# EAGLE design ESP_Irrigation (EAGLE 6.4)
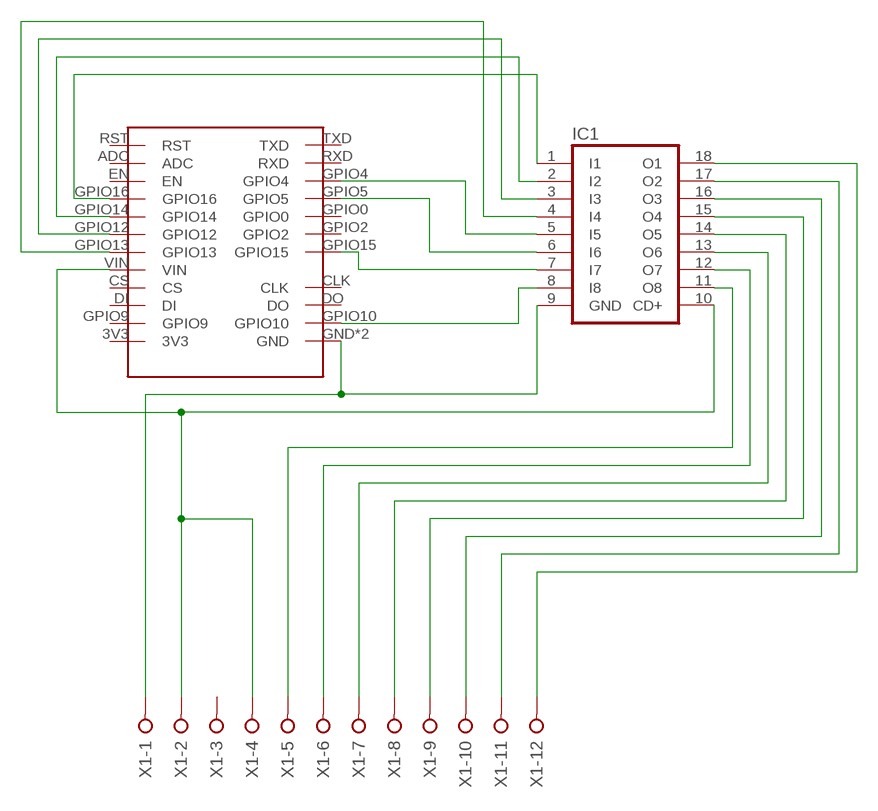
[diagram p0: schematic, sheet 1]

## Parts
IC1  ULN2803A  [DIL18]
U$1  ESP12ADAPTERBOARD  [ESP12ADAPTERBOARD]
X1  W237-12P  [W237-12P]

## Nets
N$1: IC1.17(O2) X1.11
N$2: IC1.9(GND) U$1.GND U$1.GND1(GND) X1.1
N$3: IC1.11(O8) X1.5
N$4: IC1.8(I8) U$1.GPIO10
N$5: IC1.7(I7) U$1.GPIO15
N$6: IC1.5(I5) U$1.GPIO4
N$7: IC1.6(I6) U$1.GPIO5
N$8: IC1.4(I4) U$1.GPIO13
N$10: IC1.3(I3) U$1.GPIO12
N$12: IC1.12(O7) X1.6
N$13: IC1.13(O6) X1.7
N$14: IC1.14(O5) X1.8
N$15: IC1.15(O4) X1.9
N$16: IC1.16(O3) X1.10
N$17: IC1.10(CD+) U$1.VIN X1.2 X1.4
N$18: IC1.18(O1) X1.12
N$19: IC1.1(I1) U$1.GPIO16
N$20: IC1.2(I2) U$1.GPIO14
Unconnected: U$1.3V3 U$1.ADC U$1.CLK U$1.CS U$1.DI U$1.DO U$1.EN U$1.GPIO0 U$1.GPIO2 U$1.GPIO9 U$1.RST U$1.RXD U$1.TXD X1.3

## Library data of the parts
IC1 = uln-udn:ULN2803A: DRIVER ARRAY
U$1 = esp8266modules:ESP12ADAPTERBOARD
X1 = con-wago-508:W237-12P: WAGO SREW CLAMP; OC_FARNELL: unknown; OC_NEWARK: unknown

## Board
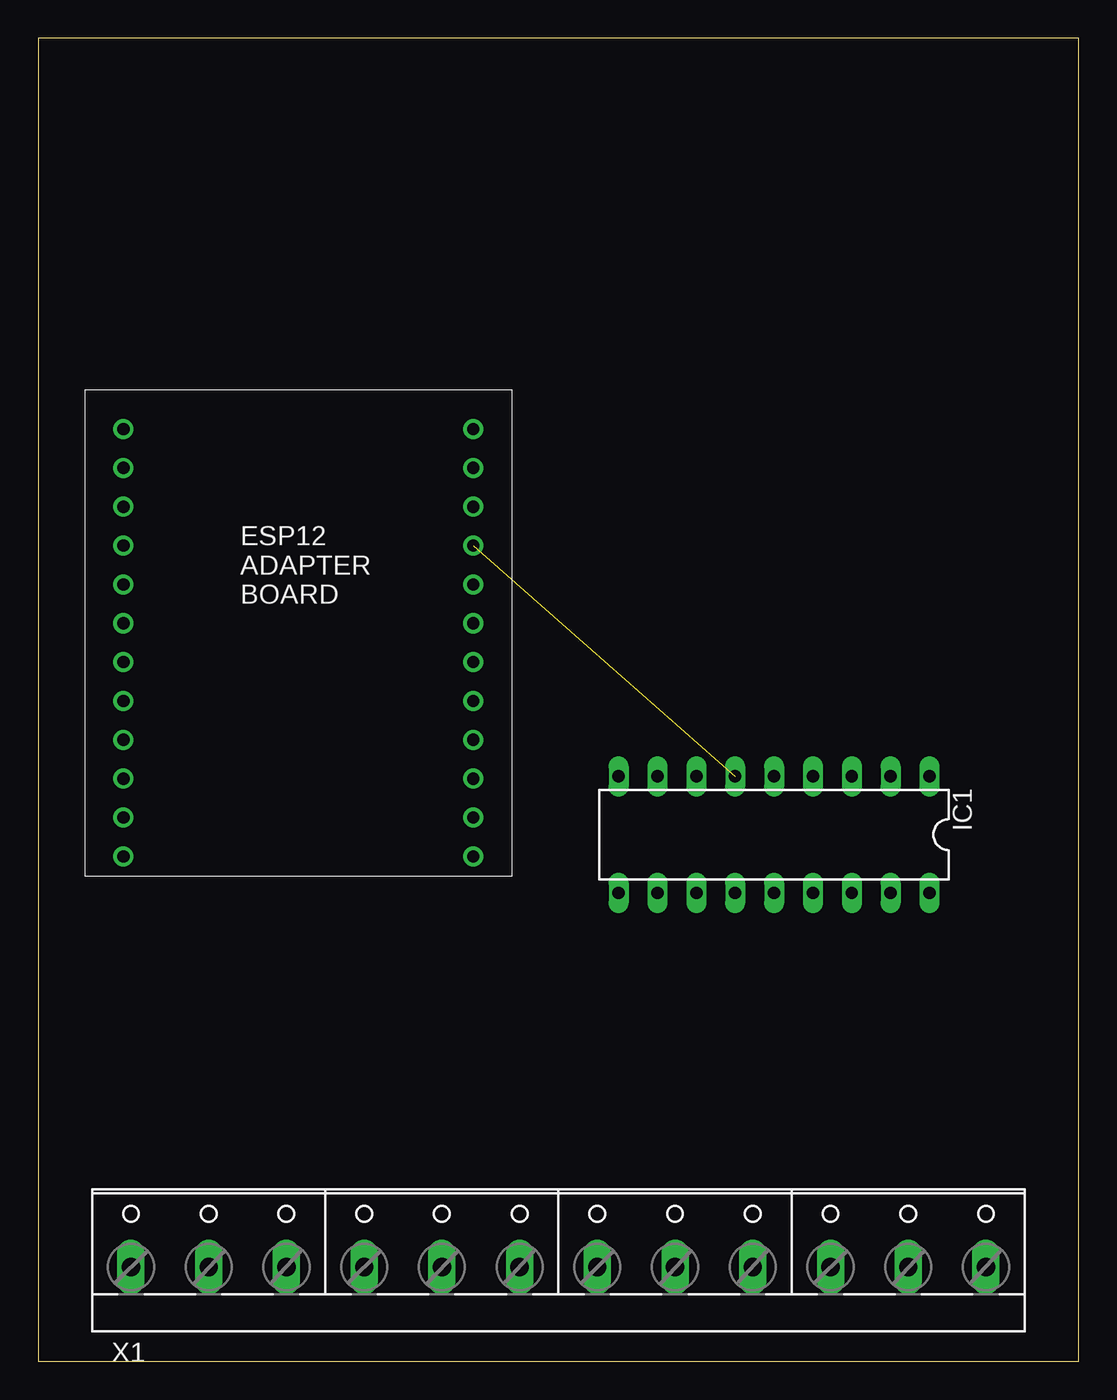
[diagram p1: board, top side]
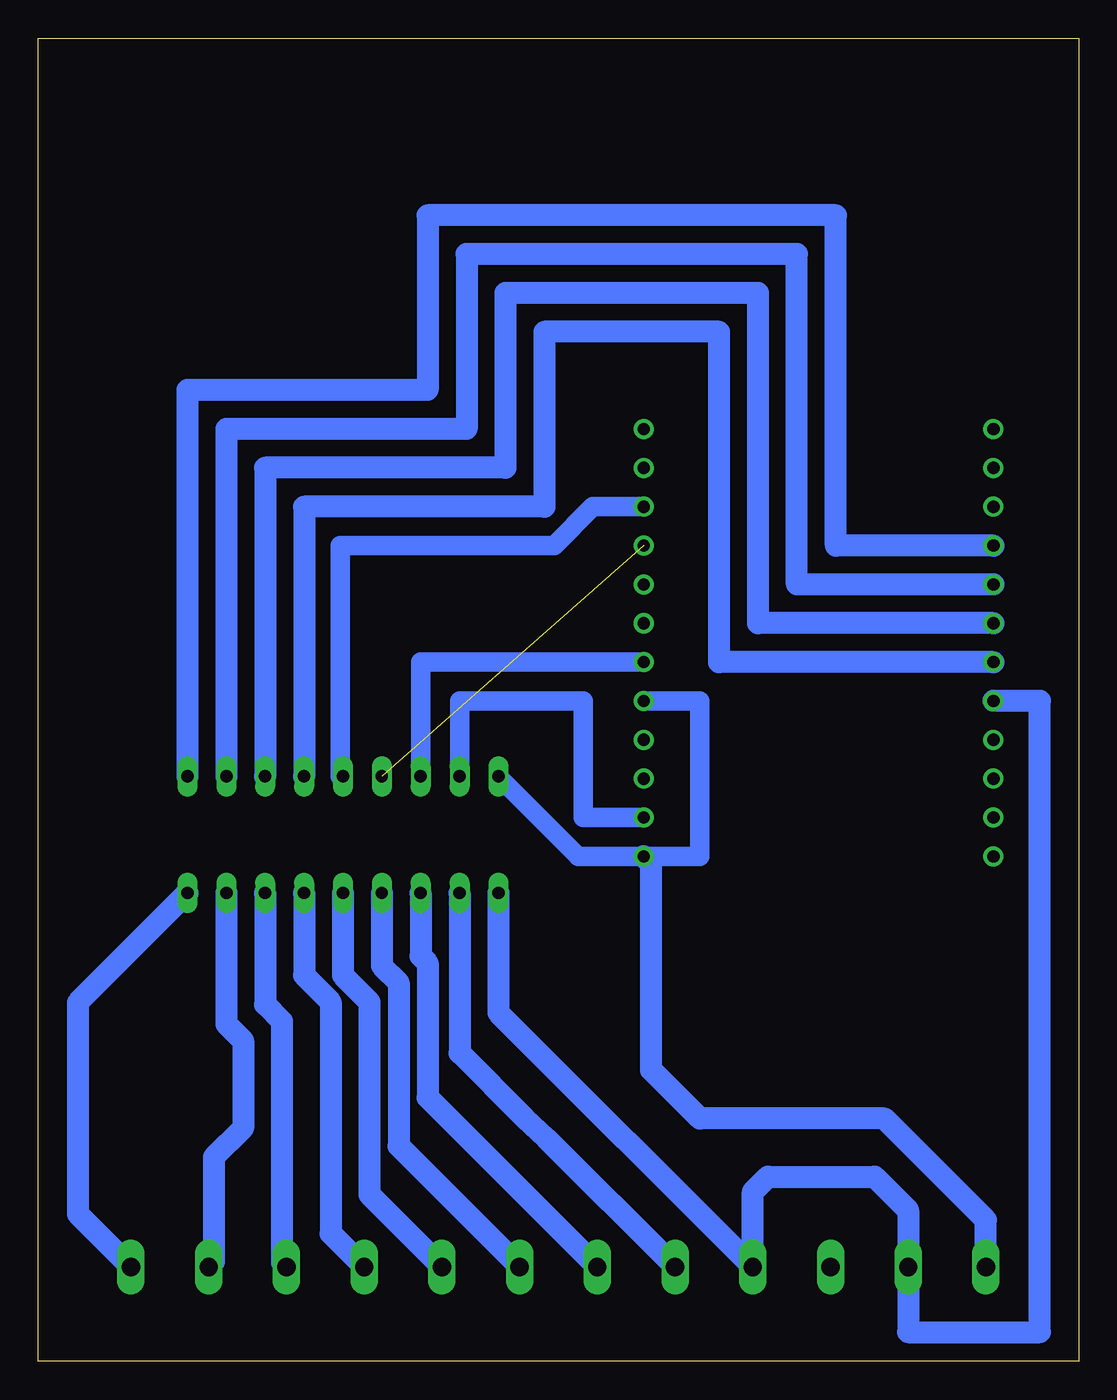
[diagram p2: board, bottom side, seen from below]

Size 68 x 86.5 mm. Coordinates in mm from the lower left corner, seen from the top.
Outline: 0,0 68,0 68,86.5 0,86.5 0,0
Copper layers (1*16): Top 0.035mm / dielectric 1.5mm / Bottom 0.035mm
Design rules "default": minimum track width 10mil, minimum drill 24mil, track to track 8mil, track to pad 8mil, pad to pad 8mil, via to via 8mil, smd to smd 8mil, copper to edge 40mil, drill to drill 8mil, minimum pad ring 10mil, minimum via ring 8mil, stop-mask expansion 4mil, vias tented up to drill 0mil, thermal gap 10mil

### Footprints (pad centres in the part's own frame; a part is rotated, then mirrored left to right if it is on the bottom)
DIL18 = drill 0.813 long: 1 -10.16,-3.81; 2 -7.62,-3.81; 3 -5.08,-3.81; 4 -2.54,-3.81; 5 0,-3.81; 6 2.54,-3.81; 7 5.08,-3.81; 8 7.62,-3.81; 9 10.16,-3.81; 10 10.16,3.81; 11 7.62,3.81; 12 5.08,3.81; 13 2.54,3.81; 14 0,3.81; 15 -2.54,3.81; 16 -5.08,3.81; 17 -7.62,3.81; 18 -10.16,3.81
ESP12ADAPTERBOARD = drill 0.8: 3V3 -11.43,-13.97; ADC -11.43,11.43; CLK 11.43,-6.35; CS -11.43,-8.89; DI -11.43,-6.35; DO 11.43,-8.89; EN -11.43,8.89; GND 11.43,-3.81; GND1 11.43,-13.97; GPIO0 11.43,3.81; GPIO2 11.43,1.27; GPIO4 11.43,8.89; GPIO5 11.43,6.35; GPIO9 -11.43,-11.43; GPIO10 11.43,-11.43; GPIO12 -11.43,1.27; GPIO13 -11.43,-1.27; GPIO14 -11.43,3.81; GPIO15 11.43,-1.27; GPIO16 -11.43,6.35; RST -11.43,13.97; RXD 11.43,11.43; TXD 11.43,13.97; VIN -11.43,-3.81
W237-12P = drill 1.194 long: 1 -27.94,-0.635; 2 -22.86,-0.635; 3 -17.78,-0.635; 4 -12.7,-0.635; 5 -7.62,-0.635; 6 -2.54,-0.635; 7 2.54,-0.635; 8 7.62,-0.635; 9 12.7,-0.635; 10 17.78,-0.635; 11 22.86,-0.635; 12 27.94,-0.635

### Placement (x,y rotation side)
IC1  48.09,34.43 180 top
U$1  17,46.98 0 top
X1  34,6.8 0 top

### Tracks (layer width: path | path; a pad name or v marks a point on that pad's centre or on a via)
N$1
  Bottom 1.422: IC1.17 55.71,22.05 54.61,20.95 54.61,15.24 56.52,13.34 56.52,6.51 X1.11
N$2
  Bottom 1.27: IC1.9 32.71,33.02 U$1.GND1 24.77,33.02 24.77,43.18 U$1.GND
  Bottom 1.422: U$1.GND1 27.94,32.52 27.94,19.05 24.77,15.88 12.7,15.88 6.06,9.23 X1.1
N$3
  Bottom 1.422: IC1.11 40.47,20.15 36.2,15.88 34.82,14.61 X1.5
N$4
  Bottom 1.27: U$1.GPIO10 32.38,35.55 32.38,43.18 40.47,43.18 IC1.8
N$5
  Bottom 1.27: U$1.GPIO15 43.01,45.71 IC1.7
N$6
  Bottom 1.27: IC1.5 48.26,38.24 48.26,53.34 34.29,53.34 31.76,55.87 U$1.GPIO4
N$7  (1 unrouted)
N$8
  Bottom 1.422: U$1.GPIO13 23.5,45.71 23.5,67.31 34.92,67.31 34.92,55.88 50.63,55.88 IC1.4
N$10
  Bottom 1.422: U$1.GPIO12 20.95,48.25 20.95,69.85 37.47,69.85 37.47,58.42 53.17,58.42 IC1.3
N$12
  Bottom 1.422: IC1.12 43.01,26.5 42.55,26.04 42.55,17.25 X1.6
N$13
  Bottom 1.422: IC1.13 45.55,25.86 44.45,24.77 44.45,14.07 X1.7
N$14
  Bottom 1.422: IC1.14 48.09,25.23 46.35,23.5 46.35,10.9 X1.8
N$15
  Bottom 1.422: IC1.15 50.63,25.23 48.9,23.5 48.9,8.36 X1.9
N$16
  Bottom 1.422: IC1.16 53.17,23.32 52.07,22.23 52.07,6.46 X1.10
N$17
  Bottom 1.422: IC1.10 37.93,22.79 X1.4 21.3,11.09 20.32,12.06 13.34,12.06 11.14,9.87 X1.2 11.14,1.91 2.54,1.91 2.54,43.17 U$1.VIN
N$18
  Bottom 1.422: IC1.18 65.41,23.46 65.41,9.63 X1.12
N$19
  Bottom 1.422: U$1.GPIO16 15.88,53.33 15.88,74.93 42.55,74.93 42.55,63.5 58.25,63.5 IC1.1
N$20
  Bottom 1.422: U$1.GPIO14 18.41,50.79 18.41,72.39 40.01,72.39 40.01,60.96 55.71,60.96 IC1.2